# EAGLE design due-levelconverter (EAGLE 7.5.0)
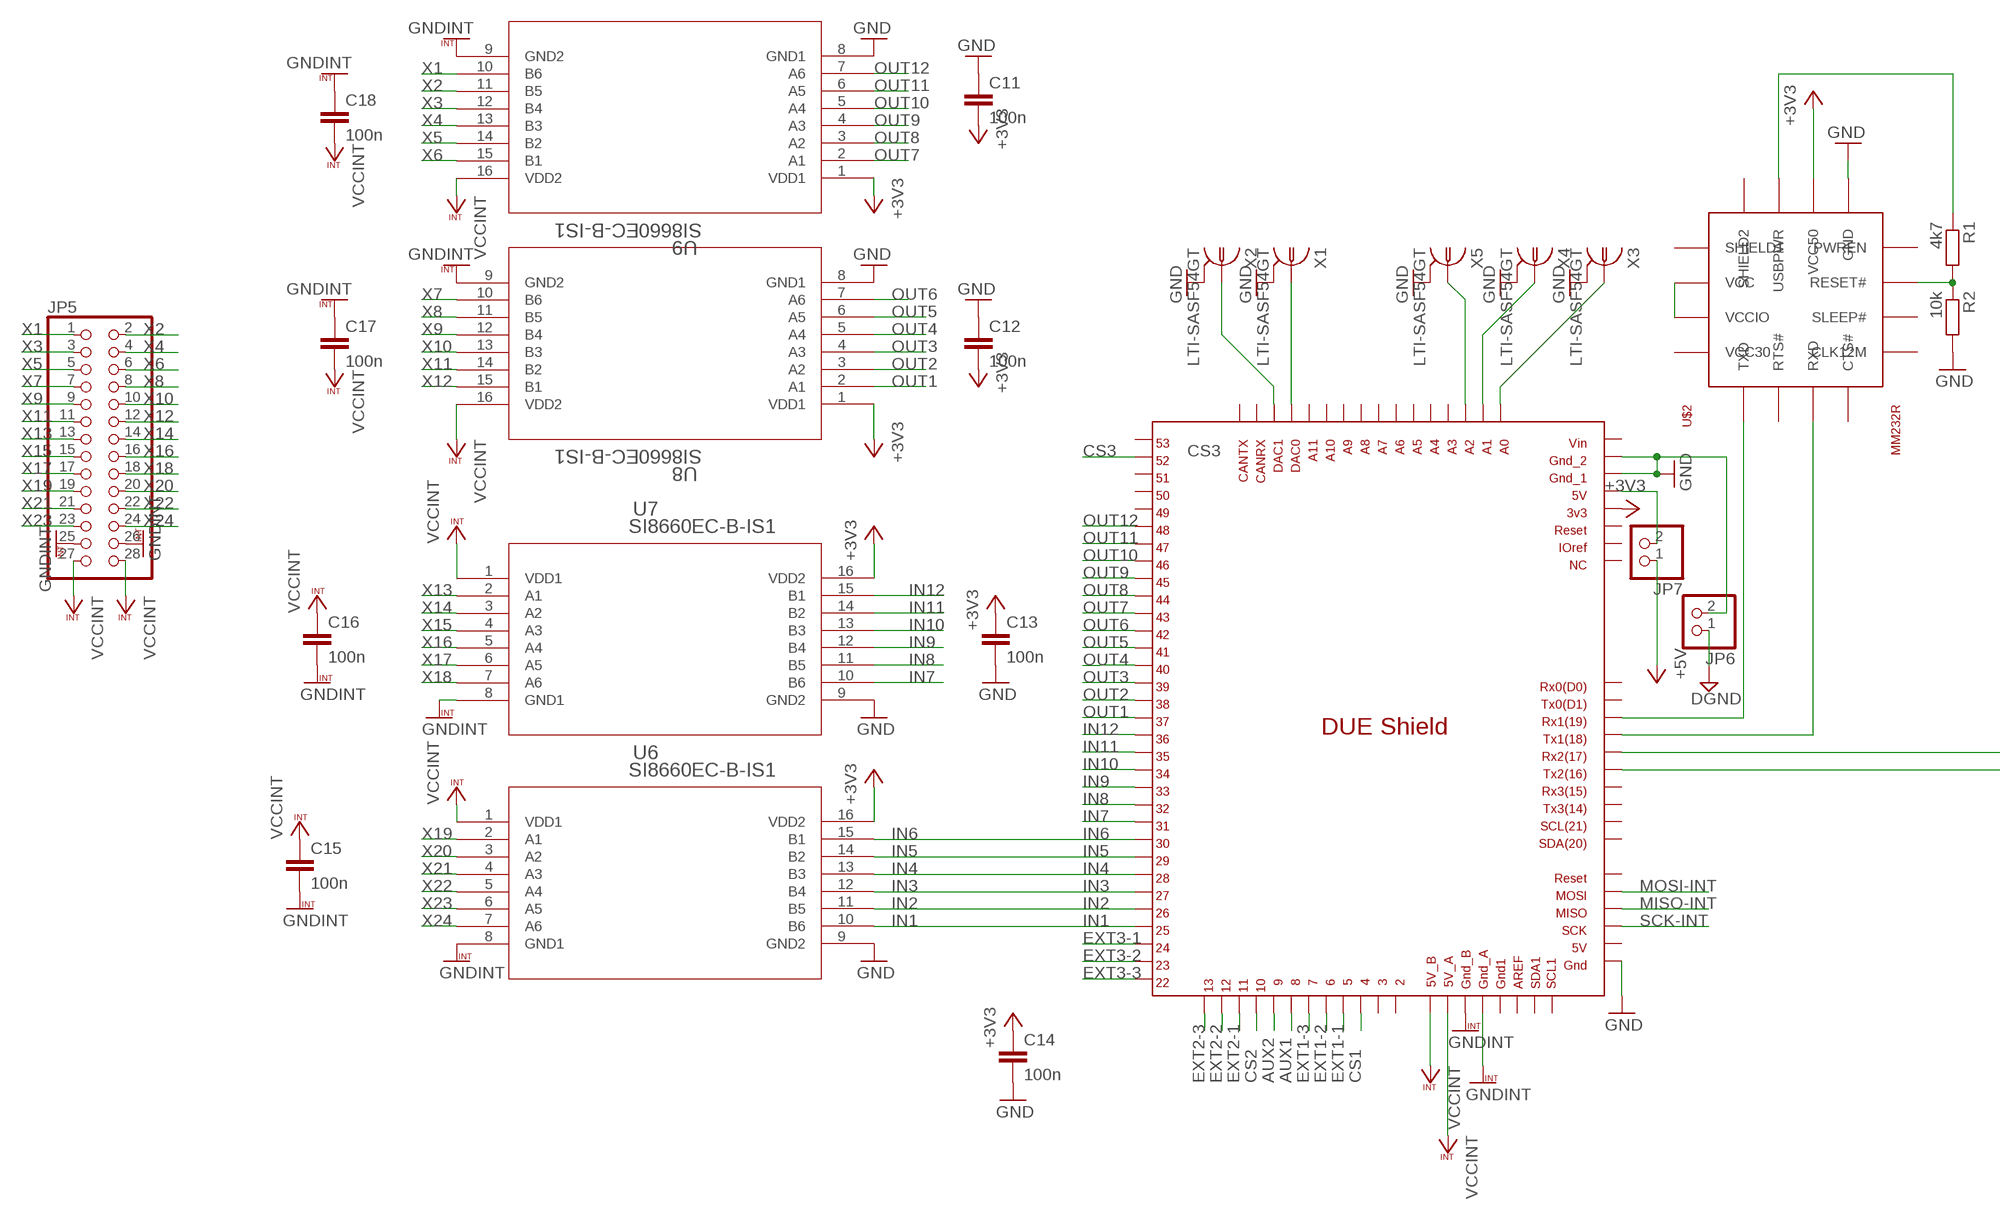
[diagram p0: schematic, sheet 1, part 1 of 2]
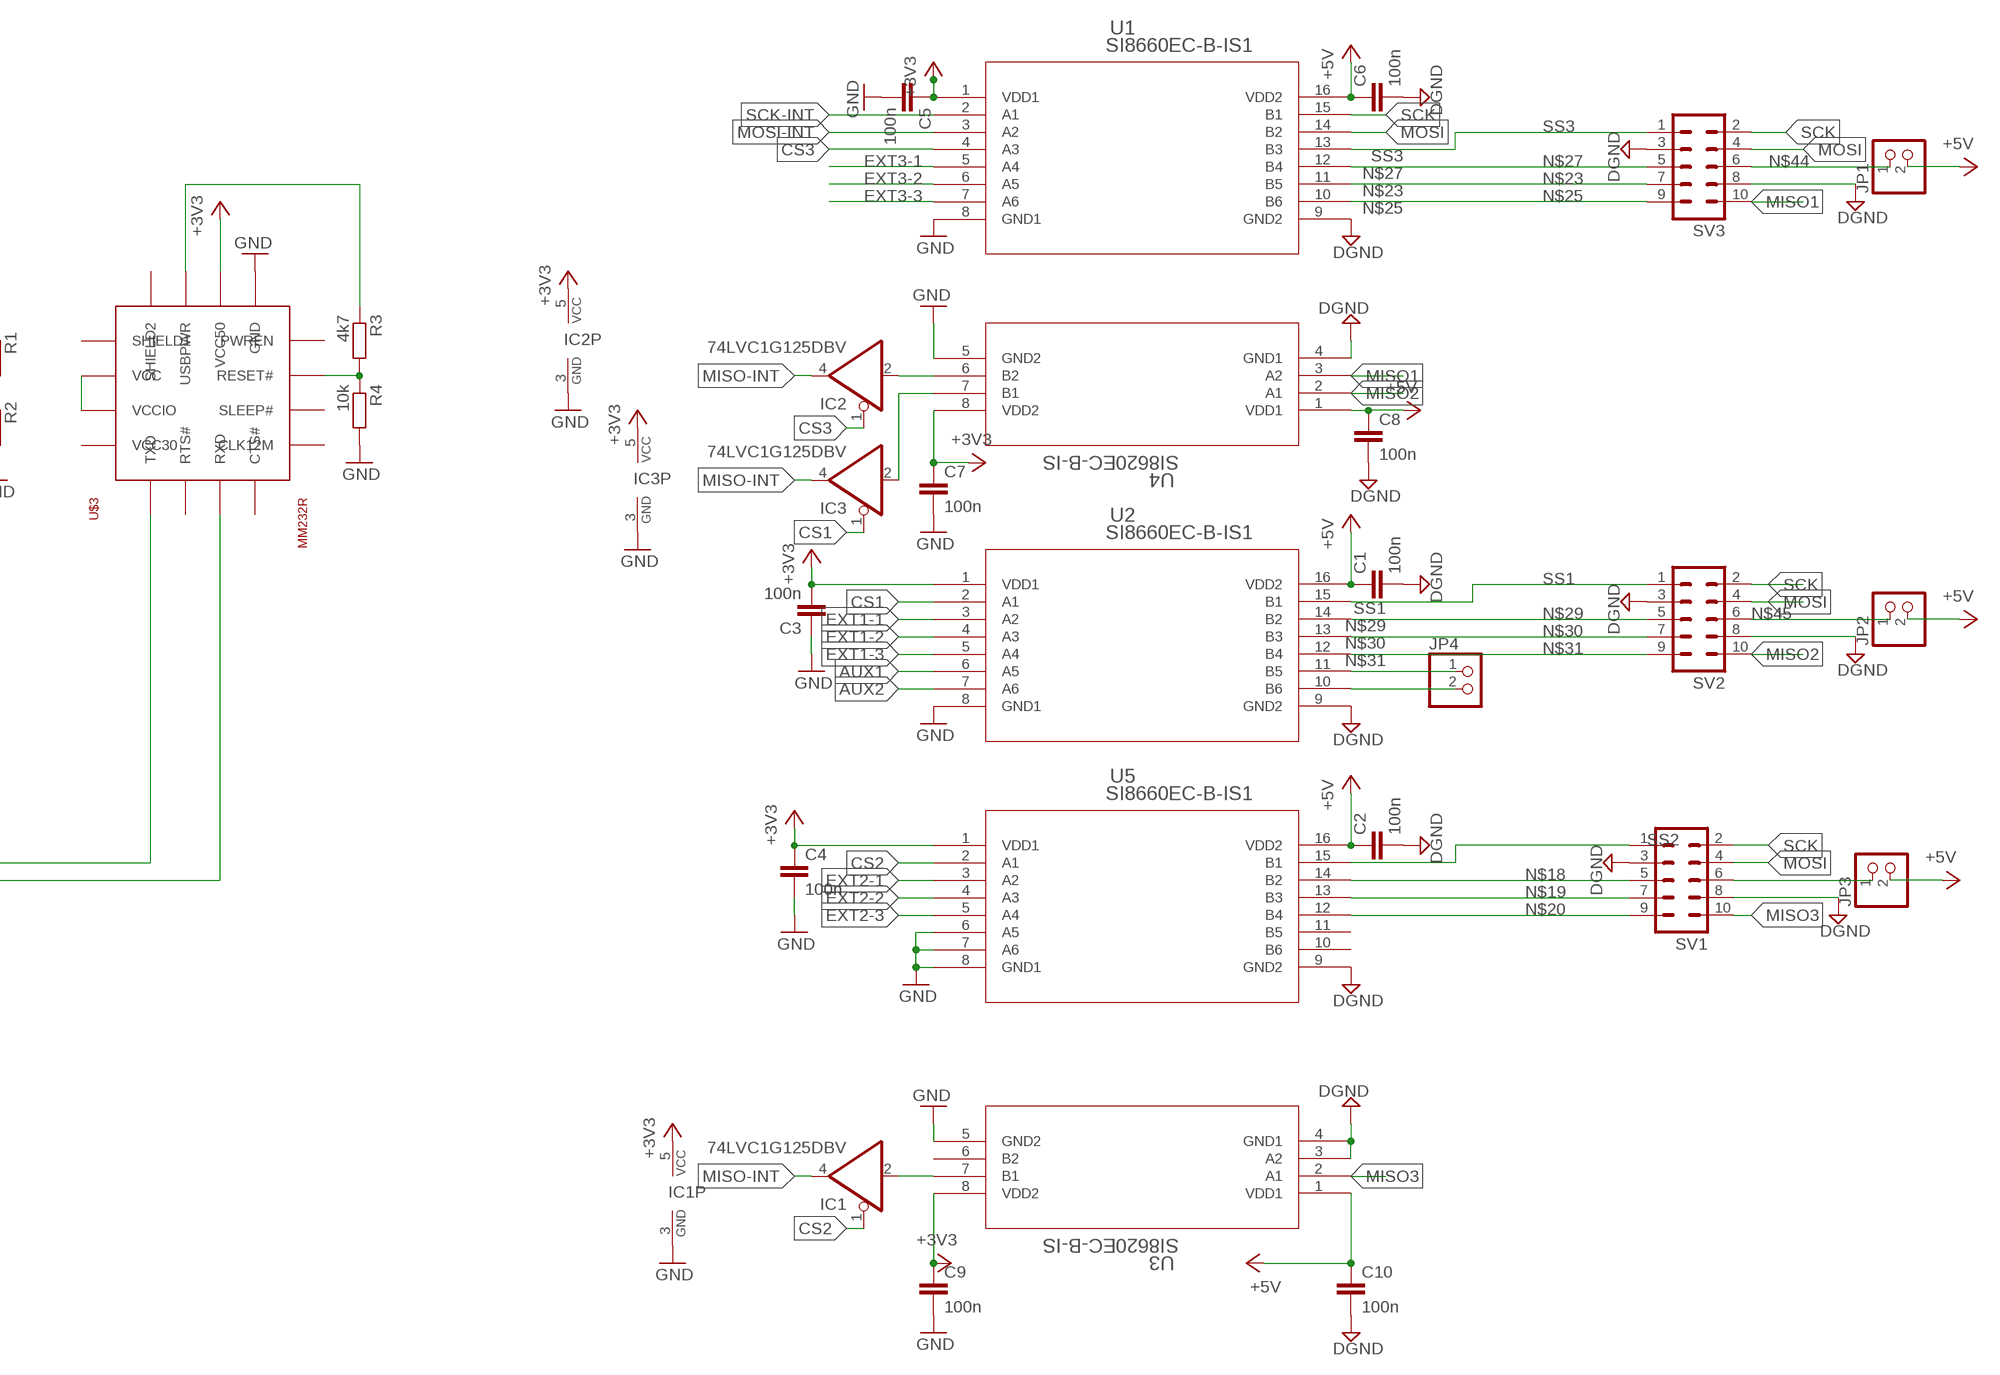
[diagram p1: schematic, sheet 1, part 2 of 2]

## Parts
C1  100n  C-EUC0805  [C0805]
C2  100n  C-EUC0805  [C0805]
C3  100n  C-EUC0805  [C0805]
C4  100n  C-EUC0805  [C0805]
C5  100n  C-EUC0805  [C0805]
C6  100n  C-EUC0805  [C0805]
C7  100n  C-EUC0805  [C0805]
C8  100n  C-EUC0805  [C0805]
C9  100n  C-EUC0805  [C0805]
C10  100n  C-EUC0805  [C0805]
C11  100n  C-EUC0805  [C0805]
C12  100n  C-EUC0805  [C0805]
C13  100n  C-EUC0805  [C0805]
C14  100n  C-EUC0805  [C0805]
C15  100n  C-EUC0805  [C0805]
C16  100n  C-EUC0805  [C0805]
C17  100n  C-EUC0805  [C0805]
C18  100n  C-EUC0805  [C0805]
IC1  74LVC1G125DBV  [SOT23-5]
IC2  74LVC1G125DBV  [SOT23-5]
IC3  74LVC1G125DBV  [SOT23-5]
JP1  PINHD-1X2  [1X02]
JP2  PINHD-1X2  [1X02]
JP3  PINHD-1X2  [1X02]
JP4  PINHD-1X2  [1X02]
JP5  PINHD-2X14  [2X14]
JP6  PINHD-1X2  [1X02]
JP7  PINHD-1X2  [1X02]
R1  4k7  R-EU_R0805  [R0805]
R2  10k  R-EU_R0805  [R0805]
R3  4k7  R-EU_R0805  [R0805]
R4  10k  R-EU_R0805  [R0805]
SV1  ML10  [ML10]
SV2  ML10  [ML10]
SV3  ML10  [ML10]
U1  SI8660EC-B-IS1  [SOIC-16]
U2  SI8660EC-B-IS1  [SOIC-16]
U3  SI8620EC-B-IS  [SOIC-8]
U4  SI8620EC-B-IS  [SOIC-8]
U5  SI8660EC-B-IS1  [SOIC-16]
U6  SI8660EC-B-IS1  [SOIC-16]
U7  SI8660EC-B-IS1  [SOIC-16]
U8  SI8660EC-B-IS1  [SOIC-16]
U9  SI8660EC-B-IS1  [SOIC-16]
U$1  DUE(NORMAL)  [DUE(NORMAL)]
U$2  MM232R  [MM232R]
U$3  MM232R  [MM232R]
X1  LTI-SASF54GT  [LTI-SASF54GT]
X2  LTI-SASF54GT  [LTI-SASF54GT]
X3  LTI-SASF54GT  [LTI-SASF54GT]
X4  LTI-SASF54GT  [LTI-SASF54GT]
X5  LTI-SASF54GT  [LTI-SASF54GT]

## Nets
+3V3: C3.2 C4.1 C5.1 C7.1 C9.1 C11.2 C12.2 C13.1 C14.1 IC1.5(VCC) IC2.5(VCC) IC3.5(VCC) U1.1(VDD1) U2.1(VDD1) U3.8(VDD2) U4.8(VDD2) U5.1(VDD1) U6.16(VDD2) U7.16(VDD2) U8.1(VDD1) U9.1(VDD1) U$1.3V3 U$2.P$14(VCC50) U$3.P$14(VCC50)
+5V: C1.1 C2.1 C6.1 C8.1 C10.1 JP1.2 JP2.2 JP3.2 JP7.1 U1.16(VDD2) U2.16(VDD2) U3.1(VDD1) U4.1(VDD1) U5.16(VDD2)
AUX1: U2.6(A5) U$1.8
AUX2: U2.7(A6) U$1.9
CS1: IC3.1(OE) U2.2(A1) U$1.4
CS2: IC1.1(OE) U5.2(A1) U$1.10
CS3: IC2.1(OE) U1.4(A3) U$1.52
DGND: C1.2 C2.2 C6.2 C8.2 C10.2 JP6.1 SV1.3 SV1.8 SV2.3 SV2.8 SV3.3 SV3.8 U1.9(GND2) U2.9(GND2) U3.3(A2) U3.4(GND1) U4.4(GND1) U5.9(GND2)
EXT1-1: U2.3(A2) U$1.5
EXT1-2: U2.4(A3) U$1.6
EXT1-3: U2.5(A4) U$1.7
EXT2-1: U5.3(A2) U$1.11
EXT2-2: U5.4(A3) U$1.12
EXT2-3: U5.5(A4) U$1.13
EXT3-1: U1.5(A4) U$1.24
EXT3-2: U1.6(A5) U$1.23
EXT3-3: U1.7(A6) U$1.22
GND: C3.1 C4.2 C5.2 C7.2 C9.2 C11.1 C12.1 C13.2 C14.2 IC1.3(GND) IC2.3(GND) IC3.3(GND) JP6.2 R2.2 R4.2 U1.8(GND1) U2.8(GND1) U3.5(GND2) U4.5(GND2) U5.6(A5) U5.7(A6) U5.8(GND1) U6.9(GND2) U7.9(GND2) U8.8(GND1) U9.8(GND1) U$1.5V_ICSP U$1.GND_1 U$1.GND_2 U$2.P$13(GND) U$3.P$13(GND) X1.2 X1.3 X1.4 X1.5 X2.2 X2.3 X2.4 X2.5 X3.2 X3.3 X3.4 X3.5 X4.2 X4.3 X4.4 X4.5 X5.2 X5.3 X5.4 X5.5
GNDINT: C15.2 C16.2 C17.1 C18.1 JP5.25 JP5.26 U6.8(GND1) U7.8(GND1) U8.9(GND2) U9.9(GND2) U$1.GND_A U$1.GND_B
IN1: U6.10(B6) U$1.25
IN2: U6.11(B5) U$1.26
IN3: U6.12(B4) U$1.27
IN4: U6.13(B3) U$1.28
IN5: U6.14(B2) U$1.29
IN6: U6.15(B1) U$1.30
IN7: U7.10(B6) U$1.31
IN8: U7.11(B5) U$1.32
IN9: U7.12(B4) U$1.33
IN10: U7.13(B3) U$1.34
IN11: U7.14(B2) U$1.35
IN12: U7.15(B1) U$1.36
MISO1: SV3.10 U4.3(A2)
MISO2: SV2.10 U4.2(A1)
MISO3: SV1.10 U3.2(A1)
MISO-INT: IC1.4(O) IC2.4(O) IC3.4(O) U$1.MISO_ICSP
MOSI: SV1.4 SV2.4 SV3.4 U1.14(B2)
MOSI-INT: U1.3(A2) U$1.MOSI_ICSP
N$1: JP7.2 U$1.5V
N$2: IC1.2(I) U3.7(B1)
N$3: U$1.DAC0 X1.1
N$4: U$1.DAC1 X2.1
N$5: U$1.A0 X3.1
N$6: U$1.A1 X4.1
N$7: U$1.A2 X5.1
N$8: U$3.P$2(VCC) U$3.P$3(VCCIO)
N$9: IC2.2(I) U4.6(B2)
N$14: U$2.P$2(VCC) U$2.P$3(VCCIO)
N$18: SV1.5 U5.14(B2)
N$19: SV1.7 U5.13(B3)
N$20: SV1.9 U5.12(B4)
N$22: IC3.2(I) U4.7(B1)
N$23: SV3.7 U1.11(B5)
N$25: SV3.9 U1.10(B6)
N$27: SV3.5 U1.12(B4)
N$29: SV2.5 U2.14(B2)
N$30: SV2.7 U2.13(B3)
N$31: SV2.9 U2.12(B4)
N$36: U$1.RX1 U$2.P$5(TXD)
N$37: U$1.TX1 U$2.P$7(RXD)
N$38: U$1.RX2 U$3.P$5(TXD)
N$39: U$1.TX2 U$3.P$7(RXD)
N$40: R1.2 R2.1 U$2.P$11(RESET#)
N$41: R3.2 R4.1 U$3.P$11(RESET#)
N$42: R1.1 U$2.P$15(USBPWR)
N$43: R3.1 U$3.P$15(USBPWR)
N$44: JP1.1 SV3.6
N$45: JP2.1 SV2.6
N$46: JP3.1 SV1.6
N$47: JP4.1 U2.11(B5)
N$48: JP4.2 U2.10(B6)
OUT1: U8.2(A1) U$1.37
OUT2: U8.3(A2) U$1.38
OUT3: U8.4(A3) U$1.39
OUT4: U8.5(A4) U$1.40
OUT5: U8.6(A5) U$1.41
OUT6: U8.7(A6) U$1.42
OUT7: U9.2(A1) U$1.43
OUT8: U9.3(A2) U$1.44
OUT9: U9.4(A3) U$1.45
OUT10: U9.5(A4) U$1.46
OUT11: U9.6(A5) U$1.47
OUT12: U9.7(A6) U$1.48
SCK: SV1.2 SV2.2 SV3.2 U1.15(B1)
SCK-INT: U1.2(A1) U$1.SCK_ICSP
SS1: SV2.1 U2.15(B1)
SS2: SV1.1 U5.15(B1)
SS3: SV3.1 U1.13(B3)
VCCINT: C15.1 C16.1 C17.2 C18.2 JP5.27 JP5.28 U6.1(VDD1) U7.1(VDD1) U8.16(VDD2) U9.16(VDD2) U$1.5V_A U$1.5V_B
X1: JP5.1 U9.10(B6)
X2: JP5.2 U9.11(B5)
X3: JP5.3 U9.12(B4)
X4: JP5.4 U9.13(B3)
X5: JP5.5 U9.14(B2)
X6: JP5.6 U9.15(B1)
X7: JP5.7 U8.10(B6)
X8: JP5.8 U8.11(B5)
X9: JP5.9 U8.12(B4)
X10: JP5.10 U8.13(B3)
X11: JP5.11 U8.14(B2)
X12: JP5.12 U8.15(B1)
X13: JP5.13 U7.2(A1)
X14: JP5.14 U7.3(A2)
X15: JP5.15 U7.4(A3)
X16: JP5.16 U7.5(A4)
X17: JP5.17 U7.6(A5)
X18: JP5.18 U7.7(A6)
X19: JP5.19 U6.2(A1)
X20: JP5.20 U6.3(A2)
X21: JP5.21 U6.4(A3)
X22: JP5.22 U6.5(A4)
X23: JP5.23 U6.6(A5)
X24: JP5.24 U6.7(A6)
Unconnected: U3.6(B2) U5.10(B6) U5.11(B5) U$1.2 U$1.3 U$1.49 U$1.50 U$1.51 U$1.53 U$1.A3 U$1.A4 U$1.A5 U$1.A6 U$1.A7 U$1.A8 U$1.A9 U$1.A10 U$1.A11 U$1.AREF U$1.CANRX U$1.CANTX U$1.GND1 U$1.GND_ICSP U$1.IOREF U$1.NC U$1.RESET U$1.RESET_ICSP U$1.RX0 U$1.RX3 U$1.SCL U$1.SCL1 U$1.SDA U$1.SDA1 U$1.TX0 U$1.TX3 U$1.VIN U$2.P$1(SHIELD1) U$2.P$4(VCC30) U$2.P$6(RTS#) U$2.P$8(CTS#) U$2.P$9(CLK12M) U$2.P$10(SLEEP#) U$2.P$12(PWREN) U$2.P$16(SHIELD2) U$3.P$1(SHIELD1) U$3.P$4(VCC30) U$3.P$6(RTS#) U$3.P$8(CTS#) U$3.P$9(CLK12M) U$3.P$10(SLEEP#) U$3.P$12(PWREN) U$3.P$16(SHIELD2)

## Library data of the parts
C1-C18 = rcl:C-EU: CAPACITOR, European symbol
IC1-IC3 = 74xx-little-de:74*1G125: Single Bus Buffer Gate with 3-State Output
JP1-JP4 JP6 JP7 = pinhead:PINHD-1X2: PIN HEADER
JP5 = pinhead:PINHD-2X14: PIN HEADER
R1-R4 = rcl:R-EU_: RESISTOR, European symbol
SV1-SV3 = con-ml:ML10: HARTING; OC_FARNELL: unknown; OC_NEWARK: unknown
U1 U2 U5-U9 = custom:SI8660EC-B-IS1
U3 U4 = custom:SI8620EC-B-IS
U$1 = due:DUE(NORMAL)
U$2 U$3 = custom:MM232R
X1-X5 = con-coax:LTI-SASF54GT: SMA vertical PCB thrue hole jack Source: Lighthorse Technologies, inc. SASF54GT.pdf; OC_FARNELL: unknown; OC_NEWARK: unknown

## Board
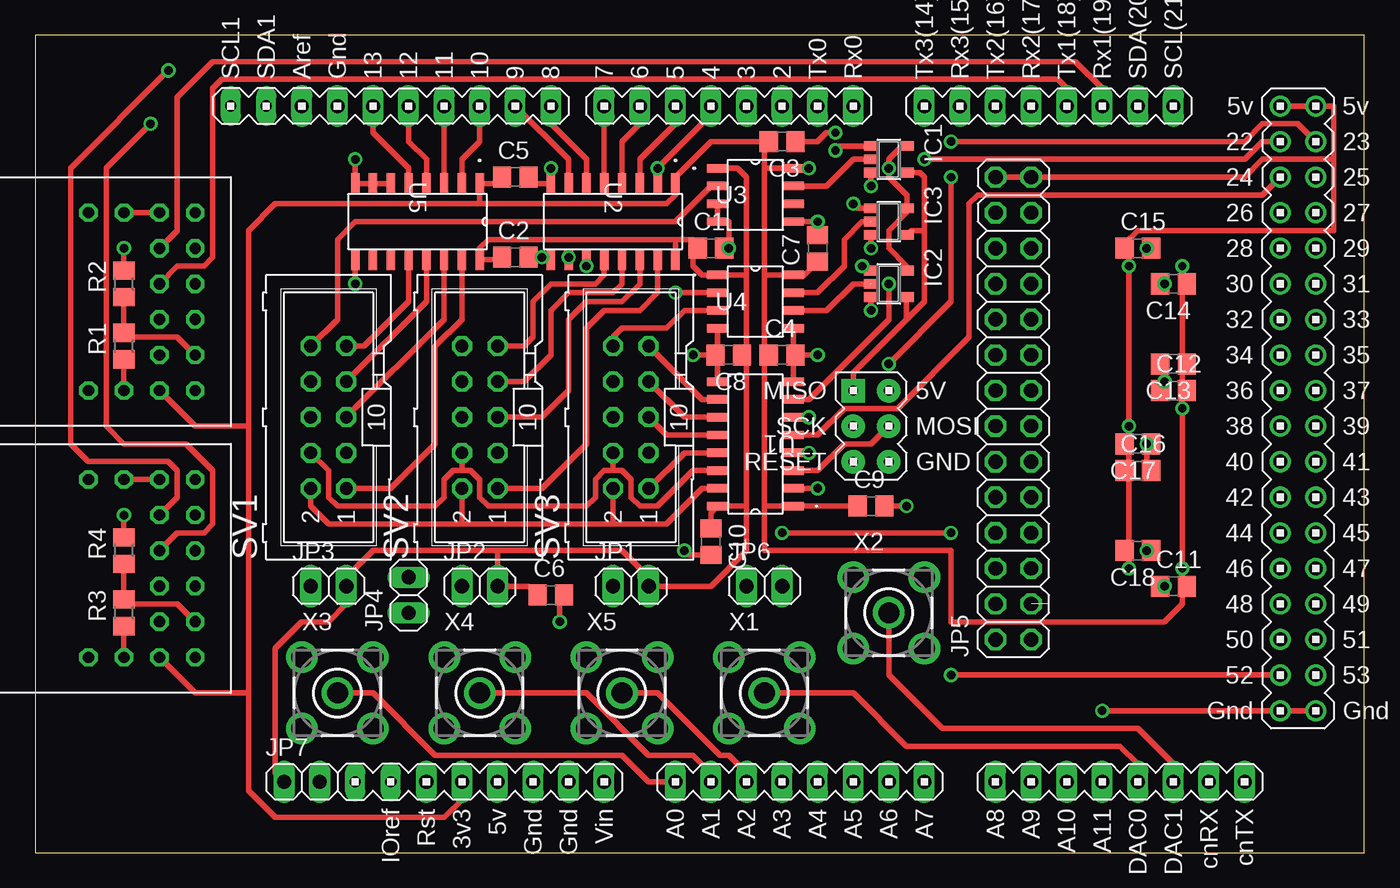
[diagram p2: board, top side]
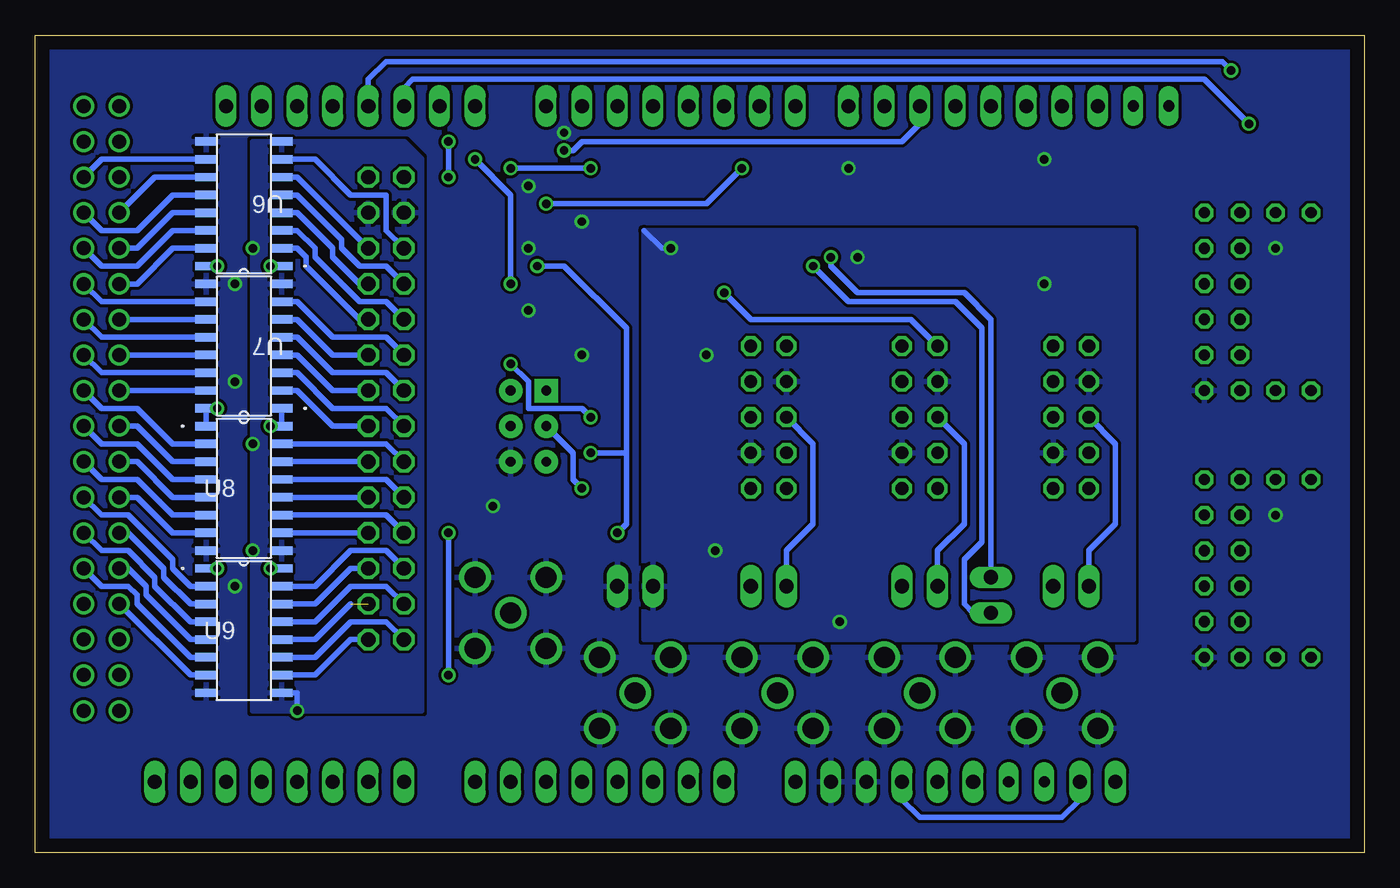
[diagram p3: board, bottom side, seen from below]

Size 94.92 x 58.41 mm. Coordinates in mm from the lower left corner, seen from the top.
Outline: 0,0 94.92,0 94.92,58.41 0,58.41 0,0
Copper layers (1*16): Top 0.035mm / dielectric 1.5mm / Bottom 0.035mm
Design rules "default": minimum track width 10mil, minimum drill 24mil, track to track 8mil, track to pad 8mil, pad to pad 8mil, via to via 8mil, smd to smd 8mil, copper to edge 40mil, drill to drill 8mil, minimum pad ring 10mil, minimum via ring 8mil, stop-mask expansion 4mil, vias tented up to drill 0mil, thermal gap 10mil

### Footprints (pad centres in the part's own frame; a part is rotated, then mirrored left to right if it is on the bottom)
C0805 = smd 1.3 x 1.5: 1 -0.95,0; 2 0.95,0
SOT23-5 = smd 0.69 x 0.99: 1 -0.95,-1.29; 2 0,-1.29; 3 0.95,-1.29; 4 0.95,1.3; 5 -0.95,1.3
1X02 = drill 1.016 long: 1 -1.27,0; 2 1.27,0
2X14 = drill 1.016 octagon: 1 -16.51,-1.27; 2 -16.51,1.27; 3 -13.97,-1.27; 4 -13.97,1.27; 5 -11.43,-1.27; 6 -11.43,1.27; 7 -8.89,-1.27; 8 -8.89,1.27; 9 -6.35,-1.27; 10 -6.35,1.27; 11 -3.81,-1.27; 12 -3.81,1.27; 13 -1.27,-1.27; 14 -1.27,1.27; 15 1.27,-1.27; 16 1.27,1.27; 17 3.81,-1.27; 18 3.81,1.27; 19 6.35,-1.27; 20 6.35,1.27; 21 8.89,-1.27; 22 8.89,1.27; 23 11.43,-1.27; 24 11.43,1.27; 25 13.97,-1.27; 26 13.97,1.27; 27 16.51,-1.27; 28 16.51,1.27
R0805 = smd 1.3 x 1.5: 1 -0.95,0; 2 0.95,0
ML10 = drill 0.914 octagon: 1 -5.08,-1.27; 2 -5.08,1.27; 3 -2.54,-1.27; 4 -2.54,1.27; 5 0,-1.27; 6 0,1.27; 7 2.54,-1.27; 8 2.54,1.27; 9 5.08,-1.27; 10 5.08,1.27
SOIC-16 = smd 1.55 x 0.6: 1 -2.7,4.445; 2 -2.7,3.175; 3 -2.7,1.905; 4 -2.7,0.635; 5 -2.7,-0.635; 6 -2.7,-1.905; 7 -2.7,-3.175; 8 -2.7,-4.445; 9 2.7,-4.445; 10 2.7,-3.175; 11 2.7,-1.905; 12 2.7,-0.635; 13 2.7,0.635; 14 2.7,1.905; 15 2.7,3.175; 16 2.7,4.445
SOIC-8 = smd 1.55 x 0.6: 1 -2.7,1.905; 2 -2.7,0.635; 3 -2.7,-0.635; 4 -2.7,-1.905; 5 2.7,-1.905; 6 2.7,-0.635; 7 2.7,0.635; 8 2.7,1.905
DUE(NORMAL) = drill 1 long: 2 -16.51,30.48; 3 -19.05,30.48; 3V3 -39.37,-17.78; 4 -21.59,30.48; 5 -24.13,30.48; 5V -36.83,-17.78; 6 -26.67,30.48; 7 -29.21,30.48; 8 -33.02,30.48; 9 -35.56,30.48; 10 -38.1,30.48; 11 -40.64,30.48; 12 -43.18,30.48; 13 -45.72,30.48; A0 -24.13,-17.78; A1 -21.59,-17.78; A2 -19.05,-17.78; A3 -16.51,-17.78; A4 -13.97,-17.78; A5 -11.43,-17.78; A6 -8.89,-17.78; A7 -6.35,-17.78; A8 -1.27,-17.78; A9 1.27,-17.78; A10 3.81,-17.78; A11 6.35,-17.78; AREF -50.8,30.48; CANRX 13.97,-17.78; CANTX 16.51,-17.78; DAC0 8.89,-17.78; DAC1 11.43,-17.78; GND1 -48.26,30.48; GND_1 -34.29,-17.78; GND_2 -31.75,-17.78; RESET -41.91,-17.78; RX0 -11.43,30.48; RX1 6.35,30.48; RX2 1.27,30.48; RX3 -3.81,30.48; SCL 11.43,30.48; SDA 8.89,30.48; TX0 -13.97,30.48; TX1 3.81,30.48; TX2 -1.27,30.48; TX3 -6.35,30.48; VIN -29.21,-17.78 | drill 1: 5V_A 19.05,30.48; 5V_B 21.59,30.48; 22 19.05,27.94; 23 21.59,27.94; 24 19.05,25.4; 25 21.59,25.4; 26 19.05,22.86; 27 21.59,22.86; 28 19.05,20.32; 29 21.59,20.32; 30 19.05,17.78; 31 21.59,17.78; 32 19.05,15.24; 33 21.59,15.24; 34 19.05,12.7; 35 21.59,12.7; 36 19.05,10.16; 37 21.59,10.16; 38 19.05,7.62; 39 21.59,7.62; 40 19.05,5.08; 41 21.59,5.08; 42 19.05,2.54; 43 21.59,2.54; 44 19.05,0; 45 21.59,0; 46 19.05,-2.54; 47 21.59,-2.54; 48 19.05,-5.08; 49 21.59,-5.08; 50 19.05,-7.62; 51 21.59,-7.62; 52 19.05,-10.16; 53 21.59,-10.16; GND_A 19.05,-12.7; GND_B 21.59,-12.7 | drill 0.7 pad 1.676: 5V_ICSP -8.89,5.08; GND_ICSP -8.89,10.16; MOSI_ICSP -8.89,7.62; RESET_ICSP -11.43,5.08; SCK_ICSP -11.43,7.62 | drill 0.8 pad 1.422 long: IOREF -44.45,-17.78; NC -46.99,-17.78; SCL1 -55.88,30.48; SDA1 -53.34,30.48 | drill 0.7 pad 1.676 square: MISO_ICSP -11.43,10.16
MM232R = drill 0.8 octagon: P$1 6.35,3.81; P$2 6.35,1.27; P$3 6.35,-1.27; P$4 6.35,-3.81; P$5 3.81,-1.27; P$6 3.81,-3.81; P$7 1.27,-1.27; P$8 1.27,-3.81; P$9 -1.27,-3.81; P$10 -1.27,-1.27; P$11 -3.81,-3.81; P$12 -3.81,-1.27; P$13 -6.35,-3.81; P$14 -6.35,-1.27; P$15 -6.35,1.27; P$16 -6.35,3.81
LTI-SASF54GT = drill 1.5 pad 2.2: 1 0,0; 2 -2.54,2.54; 3 2.54,2.54; 4 2.54,-2.54; 5 -2.54,-2.54

### Placement (x,y rotation side)
C1  48.26,43.18 0 top
C2  34.29,42.55 0 top
C3  53.34,50.8 180 top
C4  53.34,35.56 0 top
C5  34.29,48.26 0 top
C6  36.83,18.41 0 top
C7  55.88,43.18 90 top
C8  49.53,35.56 180 top
C9  59.69,24.77 0 top
C10  48.26,22.23 270 top
C11  81.28,19.05 0 top
C12  81.28,33.02 0 top
C13  81.28,34.92 180 top
C14  81.28,40.64 180 top
C15  78.74,43.18 0 top
C16  78.74,27.3 0 top
C17  78.74,29.21 180 top
C18  78.74,21.59 180 top
IC1  60.96,49.53 270 top
IC2  60.96,40.64 270 top
IC3  60.96,45.09 270 top
JP1  42.55,19.05 0 top
JP2  31.75,19.05 0 top
JP3  20.95,19.05 0 top
JP4  26.67,18.41 90 top
JP5  69.85,31.75 90 top
JP6  52.07,19.05 0 top
JP7  19.05,5.08 0 top
R1  6.35,36.2 90 top
R2  6.35,40.64 90 top
R3  6.35,17.14 90 top
R4  6.35,21.59 90 top
SV1  20.95,31.11 90 top
SV2  31.75,31.11 90 top
SV3  42.55,31.11 90 top
U1  51.44,29.21 180 top
U2  41.27,45.09 270 top
U3  51.44,46.99 0 top
U4  51.44,39.37 0 top
U5  27.3,45.09 270 top
U6  80.01,46.35 180 bottom
U7  80.01,36.2 180 bottom
U8  80.01,26.04 0 bottom
U9  80.01,15.88 0 bottom
U$1  69.85,22.86 0 top
U$2  7.62,39.37 90 top
U$3  7.62,20.32 90 top
X1  52.07,11.43 0 top
X2  60.96,17.14 0 top
X3  21.59,11.43 0 top
X4  31.75,11.43 0 top
X5  41.91,11.43 0 top

### Tracks (layer width: path | path; a pad name or v marks a point on that pad's centre or on a via)
+3V3  (via drill 0.6)
  Top 0.406: U$1.3V3 30.48,3.81 29.21,2.54 17.14,2.54 15.24,4.45 15.24,11.43 | 15.24,11.43 11.43,11.43 U$3.P$14 | U$2.P$14 11.43,30.48 15.24,30.48 | 15.24,30.48 15.24,11.43 | 31.75,46.35 45.09,46.35 45.72,46.99 U2.1 45.72,48.26 48.26,50.8 C3.2 52.07,50.48 52.07,48.9 | 31.75,46.35 17.14,46.35 15.24,44.45 15.24,30.48 | 31.75,46.35 U5.1 32.87,47.78 C5.1 | U1.1 C9.1 52.07,24.77 | 52.07,24.77 52.07,35.56 | 52.07,35.56 52.07,41.27 | 52.07,41.27 52.07,48.9 | v81.92,41.91 81.92,40.64 | 81.92,40.64 81.92,34.29 | 81.92,34.29 81.92,33.02 | 81.92,33.02 v81.92,31.75 v81.92,20.32 81.92,19.05 | C13.1 82.23,34.6 81.92,34.29 | C12.2 81.92,33.02 | C14.1 81.92,40.64 | C11.2 81.92,19.05 | 52.07,24.77 52.07,21.59 65.41,21.59 65.41,16.51 80.64,16.51 81.92,17.78 81.92,19.05 | 52.07,48.9 U3.8 v55.24,48.9 | 52.07,41.27 U4.8 54.92,41.27 C7.1 | C4.1 52.07,35.56 | IC1.5 61.91,50.48 60.96,49.53 v60.96,48.9 60.96,48.26 62.26,46.96 IC3.5 62.26,45.75 60.96,44.45 60.96,43.18 62.23,41.91 62.23,41.62 IC2.5
  Bottom 0.406: U6.16 v81.92,41.91 | v81.92,31.75 U7.16 U8.1 | U9.1 v81.92,20.32 | v60.96,48.9 v55.24,48.9
+5V
  Top 0.406: C2.1 33.18,42.38 U5.16 31.75,43.18 32.38,43.81 45.72,43.81 | 46.99,43.5 46.99,43.81 45.72,43.81 | 46.99,43.5 C1.1 46.99,43.18 | U2.16 45.72,43.81 | 50.8,24.77 U1.16 48.26,24.29 C10.1 | 50.8,24.77 50.8,35.56 | 50.8,35.56 50.8,41.27 | 50.8,24.77 50.8,21.59 48.26,19.05 JP1.2 43.18,19.68 43.18,20.32 41.91,21.59 33.02,21.59 | 33.02,21.59 24.13,21.59 22.23,19.68 JP3.2 22.23,17.78 20.95,16.51 19.05,16.51 17.14,14.61 17.14,5.71 JP7.1 | 33.02,21.59 JP2.2 35.24,19.05 C6.1 | 46.99,43.18 46.99,41.91 47.62,41.27 U4.1 50.8,41.27 | 46.99,43.18 46.99,43.5 | C8.1 50.8,35.56 | U3.1 50.16,48.9 50.8,48.26 50.8,41.27
AUX1
  Top 0.406: U2.6 39.37,49.53 36.83,52.07 U$1.8
AUX2
  Top 0.406: U2.7 38.1,49.53 U$1.9
CS1  (via drill 0.6)
  Top 0.406: U2.2 v44.45,48.9 48.26,52.7 U$1.4 | IC3.1 58.74,46.03 v58.42,46.35
  Bottom 0.406: v58.42,46.35 46.99,46.35 v44.45,48.9
CS2  (via drill 0.6)
  Top 0.406: U5.2 30.48,49.53 31.75,50.8 U$1.10 | IC1.1 57.47,50.48 v57.15,50.16
  Bottom 0.406: v57.15,50.16 56.52,50.16 55.88,50.8 33.02,50.8 31.75,52.07 U$1.10
CS3  (via drill 0.6)
  Top 0.406: IC2.1 59.38,41.59 v59.05,41.91 | v55.24,28.57 U1.4 | U$1.52 v65.41,12.7 | v53.34,22.86 v65.41,22.86
  Bottom 0.406: v59.05,41.91 57.15,41.91 52.7,37.47 52.7,28.57 | 52.7,28.57 v55.24,28.57 | v65.41,12.7 v65.41,22.86 | v53.34,22.86 52.7,23.5 52.7,28.57
DGND  (via drill 0.6)
  Top 0.406: U5.9 v22.86,40.64 | U2.9 36.35,42.38 v36.2,42.55 C2.2 | 37.78,18.1 C6.2 37.47,18.1 v37.47,16.51 | C1.2 v49.53,43.18 | C10.2 46.67,21.27 v46.35,21.59 | 49.37,43.34 v49.53,43.18 | U3.3 U3.4 49.53,45.09 v49.53,43.18 | U4.4 48.73,35.56 | 48.73,35.56 U1.9 | 48.73,35.56 C8.2 v46.99,35.56
  Bottom 0.406: v49.53,43.18 50.16,43.18 51.44,44.45
  pour Bottom: 16.51,44.45 51.44,44.45 51.44,15.24 16.51,15.24
EXT1-1
  Top 0.406: U2.3 43.18,49.53 45.72,52.07 U$1.5
EXT1-2
  Top 0.406: U2.4 41.91,50.8 43.18,52.07 U$1.6
EXT1-3
  Top 0.406: U2.5 U$1.7
EXT2-1
  Top 0.406: U5.3 U$1.11
EXT2-2
  Top 0.406: U5.4 27.94,49.53 26.67,50.8 U$1.12
EXT2-3
  Top 0.406: U5.5 26.67,48.9 24.13,51.44 U$1.13
EXT3-1
  Top 0.406: U1.5 55.88,29.84 57.78,31.75 61.59,31.75 66.67,36.83 66.67,46.35 67.31,46.99 87.63,46.99 U$1.24
EXT3-2  (via drill 0.6)
  Top 0.406: v65.41,50.8 86.36,50.8 87.63,52.07 90.17,52.07 U$1.23 | v55.24,31.11 U1.6 | v65.41,48.26 65.41,39.37 v60.96,34.92
  Bottom 0.406: v65.41,48.26 v65.41,50.8 | v55.24,31.11 55.88,31.75 59.69,31.75 59.69,33.66 v60.96,34.92
EXT3-3  (via drill 0.6)
  Top 0.406: U1.7 55.24,32.38 60.96,38.1 v60.96,40.64 | v63.5,49.53 86.36,49.53 87.63,50.8 U$1.22
  Bottom 0.406: v60.96,40.64 60.96,46.99 v63.5,49.53
GND  (via drill 0.6)
  Top 0.406: IC3.3 59.67,43.84 v59.69,43.18 | IC1.3 59.67,47.65 v59.69,47.62 | v36.83,48.9 U2.8 35.72,47.78 C5.2 | v22.86,49.53 U5.8 U5.7 U5.6 | C9.2 v62.23,24.77 | IC2.3 59.67,38.76 v59.69,38.73 | C11.1 v80.64,19.05 | C13.2 80.64,34.92 v80.64,33.66 80.64,33.02 C12.1 | C14.2 v80.64,40.64 | U1.8 54.13,35.41 C4.2 54.13,35.72 U4.5 54.13,36.03 54.61,35.56 v55.88,35.56 | v57.15,51.44 56.52,51.44 55.88,50.8 C3.1 | U3.5 v55.88,45.09 C7.2 | R2.2 v6.35,43.18 | R4.2 v6.35,24.13
  pour Bottom (rank 3): 0,58.42 95.25,58.42 95.25,0 0,0
GNDINT  (via drill 0.6)
  Top 0.406: U$1.GND_B U$1.GND_A v76.2,10.16 | C15.2 v79.38,43.18 | v79.38,29.21 C17.1 79.38,28.89 79.38,27.3 C16.2 | C18.1 v79.38,21.59
  Bottom 0.406: v76.2,10.16 76.2,11.43 U9.9
  pour Bottom: 79.38,50.8 68.58,50.8 67.31,49.53 67.31,10.16 79.38,10.16
IN1
  Bottom 0.406: U6.10 90.17,49.53 U$1.25
IN2
  Bottom 0.406: U6.11 86.36,48.26 U$1.26
IN3
  Bottom 0.406: U6.12 85.09,46.99 87.63,44.45 90.17,44.45 U$1.27
IN4
  Bottom 0.406: U6.13 85.09,45.72 87.63,43.18 U$1.28
IN5
  Bottom 0.406: U6.14 85.09,44.45 87.63,41.91 90.17,41.91 U$1.29
IN6
  Bottom 0.406: U6.15 85.09,43.18 87.63,40.64 U$1.30
IN7
  Bottom 0.406: U7.10 90.17,39.37 U$1.31
IN8
  Bottom 0.406: U7.11 U$1.32
IN9
  Bottom 0.406: U7.12 90.17,36.83 U$1.33
IN10
  Bottom 0.406: U7.13 U$1.34
IN11
  Bottom 0.406: U7.14 90.17,34.29 U$1.35
IN12
  Bottom 0.406: U7.15 U$1.36
MISO1
  Top 0.406: SV3.10 41.27,36.83 41.91,37.47 45.09,37.47 46.35,38.73 U4.3
MISO2  (via drill 0.6)
  Top 0.406: v45.72,40.01 U4.2
  Bottom 0.406: v45.72,40.01 43.81,38.1 32.38,38.1 SV2.10
MISO3
  Top 0.406: SV1.10 21.59,38.1 21.59,43.81 22.86,45.09 45.72,45.09 48.26,47.62 U3.2
MISO-INT
  Top 0.406: IC1.4 63.18,48.58 63.5,48.26 63.5,44.45 | 63.5,44.45 63.5,39.37 62.23,38.1 | IC3.4 62.58,44.45 63.5,44.45 | U$1.MISO_ICSP 58.42,34.29 62.23,38.1 | 62.23,38.1 62.23,39.66 IC2.4
MOSI
  Top 0.406: U1.14 46.99,27.3 44.45,24.77 43.18,24.77 42.55,25.4 42.55,26.67 41.91,27.3 41.27,27.3 | SV1.4 20.95,27.3 20.95,25.4 21.59,24.77 28.57,24.77 29.21,25.4 29.21,26.67 29.84,27.3 30.48,27.3 | 41.27,27.3 40.64,27.3 40.01,26.67 40.01,25.4 39.37,24.77 32.38,24.77 31.75,25.4 31.75,26.67 31.11,27.3 30.48,27.3 | SV3.4 41.27,27.3 | SV2.4 30.48,27.3
MOSI-INT
  Top 0.406: U$1.MOSI_ICSP 59.69,29.21 57.78,29.21 55.88,27.3 U1.3
N$1
  Bottom 0.406: U$1.5V 33.02,3.81 31.75,2.54 21.59,2.54 20.32,3.81 JP7.2
N$2
  Top 0.406: U3.7 56.52,47.62 58.42,49.53 IC1.2
N$3
  Top 0.406: U$1.DAC0 78.74,6.35 77.47,7.62 62.23,7.62 58.42,11.43 X1.1
N$4
  Top 0.406: X2.1 60.96,12.7 64.77,8.89 78.74,8.89 81.28,6.35 U$1.DAC1
N$5
  Top 0.406: X3.1 24.13,11.43 28.57,6.99 41.91,6.99 43.81,5.08 U$1.A0
N$6
  Top 0.406: U$1.A1 48.26,5.71 46.99,6.99 43.81,6.99 39.37,11.43 X4.1
N$7
  Top 0.406: U$1.A2 50.8,5.71 49.53,6.99 48.9,6.99 44.45,11.43 X5.1
N$8
  Top 0.406: U$3.P$2 U$3.P$3
N$9
  Top 0.406: U4.6 56.52,38.73 58.42,40.64 IC2.2
N$14
  Top 0.406: U$2.P$2 U$2.P$3
N$18
  Top 0.406: U5.14 29.21,38.1 SV1.5
N$19
  Top 0.406: U5.13 27.94,39.37 SV1.7
N$20
  Top 0.406: U5.12 26.67,39.37 23.5,36.2 SV1.9
N$22
  Top 0.406: IC3.2 59.05,45.09 57.78,43.81 57.78,41.91 55.88,40.01 U4.7
N$23
  Top 0.406: U1.11 46.35,31.11 SV3.7
N$25
  Top 0.406: U1.10 47.62,32.38 SV3.9
N$27
  Top 0.406: U1.12 45.09,29.84 SV3.5
N$29
  Top 0.406: U2.14 43.18,40.64 41.91,39.37 39.37,39.37 38.1,38.1 38.1,33.02 36.2,31.11 SV2.5
N$30
  Top 0.406: U2.13 41.91,40.64 41.27,40.01 38.1,40.01 36.83,38.73 36.83,35.56 34.92,33.66 SV2.7
N$31
  Top 0.406: U2.12 40.64,41.27 40.01,40.64 36.83,40.64 35.56,39.37 35.56,36.83 34.92,36.2 SV2.9
N$36
  Top 0.406: U$2.P$5 10.16,44.45 10.16,53.98 12.7,56.52 74.3,56.52 76.2,54.61 U$1.RX1
N$37
  Top 0.406: U$2.P$7 10.16,41.91 12.06,41.91 12.7,42.55 12.7,54.61 13.34,55.24 73.03,55.24 73.66,54.61 U$1.TX1
N$38  (via drill 0.6)
  Top 0.406: v9.53,55.88 2.54,48.9 2.54,29.21 3.81,27.94 9.53,27.94 10.16,27.3 10.16,25.4 U$3.P$5
  Bottom 0.406: U$1.RX2 71.12,55.24 69.85,56.52 10.16,56.52 v9.53,55.88
N$39  (via drill 0.6)
  Top 0.406: v8.26,52.07 5.08,48.9 5.08,30.48 6.35,29.21 10.79,29.21 12.7,27.3 12.7,23.5 12.06,22.86 10.16,22.86 U$3.P$7
  Bottom 0.406: U$1.TX2 68.58,54.61 67.94,55.24 11.43,55.24 v8.26,52.07
N$40
  Top 0.406: U$2.P$11 10.16,36.83 6.67,36.83 R1.2 R2.1
N$41
  Top 0.406: U$3.P$11 10.16,17.78 6.67,17.78 R3.2 R4.1
N$42
  Top 0.406: U$2.P$15 R1.1
N$43
  Top 0.406: U$3.P$15 R3.1
N$44
  Bottom 0.406: JP1.1 41.27,21.59 39.37,23.5 39.37,29.21 SV3.6
N$45
  Bottom 0.406: JP2.1 30.48,21.59 28.57,23.5 28.57,29.21 SV2.6
N$46
  Bottom 0.406: JP3.1 19.68,21.59 17.78,23.5 17.78,29.21 SV1.6
N$47  (via drill 0.6)
  Top 0.406: U2.11 v39.37,41.91
  Bottom 0.406: v39.37,41.91 36.83,39.37 29.21,39.37 27.3,37.47 27.3,22.23 28.57,20.95 28.57,17.78 27.94,17.14 JP4.1
N$48  (via drill 0.6)
  Top 0.406: U2.10 v38.1,42.55
  Bottom 0.406: v38.1,42.55 38.1,41.91 36.2,40.01 28.57,40.01 26.67,38.1 JP4.2
OUT1
  Bottom 0.406: U8.2 85.09,29.21 87.63,31.75 90.17,31.75 U$1.37
OUT2
  Bottom 0.406: U8.3 85.09,27.94 87.63,30.48 U$1.38
OUT3
  Bottom 0.406: U8.4 85.09,26.67 87.63,29.21 90.17,29.21 U$1.39
OUT4
  Bottom 0.406: U8.5 85.09,25.4 87.63,27.94 U$1.40
OUT5
  Bottom 0.406: U8.6 85.09,24.13 87.63,26.67 90.17,26.67 U$1.41
OUT6
  Bottom 0.406: U8.7 85.09,22.86 87.63,25.4 U$1.42
OUT7
  Bottom 0.406: U9.2 83.82,19.05 85.09,20.32 85.09,20.95 88.27,24.13 90.17,24.13 U$1.43
OUT8
  Bottom 0.406: U9.3 83.82,17.78 85.72,19.68 85.72,20.32 88.27,22.86 U$1.44
OUT9
  Bottom 0.406: U9.4 83.82,16.51 86.36,19.05 86.36,19.68 88.27,21.59 90.17,21.59 U$1.45
OUT10
  Bottom 0.406: U9.5 83.82,15.24 87,18.41 87,19.05 88.27,20.32 U$1.46
OUT11
  Bottom 0.406: U9.6 83.82,13.97 87.63,17.78 87.63,18.41 88.27,19.05 90.17,19.05 U$1.47
OUT12
  Bottom 0.406: U9.7 83.82,12.7 U$1.48
SCK
  Top 0.406: U1.15 47.62,26.04 45.09,23.5 41.27,23.5 | 41.27,23.5 30.48,23.5 | 30.48,23.5 20.95,23.5 19.68,24.77 SV1.2 | SV2.2 30.48,23.5 | SV3.2 41.27,23.5
SCK-INT  (via drill 0.6)
  Top 0.406: U1.2 v55.88,26.04
  Bottom 0.406: v55.88,26.04 56.52,26.67 56.52,28.57 U$1.SCK_ICSP
SS1
  Top 0.406: U2.15 44.45,40.01 43.18,38.73 40.64,38.73 39.37,37.47 39.37,29.21 36.2,26.04 SV2.1
SS2
  Top 0.406: U5.15 30.48,38.1 28.57,36.2 28.57,29.21 25.4,26.04 SV1.1
SS3
  Top 0.406: U1.13 46.35,28.57 SV3.1
VCCINT  (via drill 0.6)
  Top 0.406: JP5.28 JP5.27 86.36,48.26 87.63,49.53 92.71,49.53 | 92.71,49.53 92.71,53.34 U$1.5V_B U$1.5V_A | 92.71,49.53 92.71,44.45 78.74,44.45 77.79,43.5 C15.1 78.11,42.87 v78.11,41.91 v78.11,30.48 78.11,29.52 C17.2 78.11,29.21 78.11,27.62 C16.1 78.11,27.3 78.11,21.27 | v78.11,20.32 78.11,21.27 | 78.11,21.27 C18.2
  Bottom 0.406: U7.1 U8.16 v78.11,30.48 | U9.16 v78.11,20.32 | U6.1 v78.11,41.91
X1
  Bottom 0.406: U9.10 74.93,12.7 72.39,15.24 JP5.1
X2
  Bottom 0.406: U9.11 74.93,13.97 72.39,16.51 69.85,16.51 JP5.2
X3  (1 unrouted)
  Bottom 0.406: U9.12 74.93,15.24 72.39,17.78
X4
  Bottom 0.406: U9.13 74.93,16.51 72.39,19.05 69.85,19.05 JP5.4
X5
  Bottom 0.406: U9.14 74.93,17.78 72.39,20.32 JP5.5
X6
  Bottom 0.406: U9.15 74.93,19.05 72.39,21.59 69.85,21.59 JP5.6
X7
  Bottom 0.406: U8.10 JP5.7
X8
  Bottom 0.406: U8.11 69.85,24.13 JP5.8
X9
  Bottom 0.406: U8.12 JP5.9
X10
  Bottom 0.406: U8.13 69.85,26.67 JP5.10
X11
  Bottom 0.406: U8.14 JP5.11
X12
  Bottom 0.406: U8.15 69.85,29.21 JP5.12
X13
  Bottom 0.406: U7.2 76.2,33.02 73.66,30.48 JP5.13
X14
  Bottom 0.406: U7.3 76.2,34.29 73.66,31.75 69.85,31.75 JP5.14
X15
  Bottom 0.406: U7.4 76.2,35.56 73.66,33.02 JP5.15
X16
  Bottom 0.406: U7.5 76.2,36.83 73.66,34.29 69.85,34.29 JP5.16
X17
  Bottom 0.406: U7.6 76.2,38.1 73.66,35.56 JP5.17
X18
  Bottom 0.406: U7.7 76.2,39.37 73.66,36.83 69.85,36.83 JP5.18
X19
  Bottom 0.406: U6.2 76.2,43.18 75.56,42.55 75.56,41.91 71.75,38.1 JP5.19
X20
  Bottom 0.406: U6.3 76.2,44.45 74.93,43.18 74.93,42.55 71.75,39.37 69.85,39.37 JP5.20
X21
  Bottom 0.406: U6.4 76.2,45.72 73.66,43.18 73.66,42.55 71.75,40.64 JP5.21
X22
  Bottom 0.406: U6.5 76.2,46.99 73.03,43.81 73.03,43.18 71.75,41.91 69.85,41.91 JP5.22
X23
  Bottom 0.406: U6.6 76.2,48.26 JP5.23
X24
  Bottom 0.406: JP5.24 69.85,44.45 69.85,46.99 72.39,46.99 74.93,49.53 U6.7